# Altium schematic sheet ISP_CONNECTORS.SchDoc
size Letter; SheetNumber: 4; SheetTotal: 15
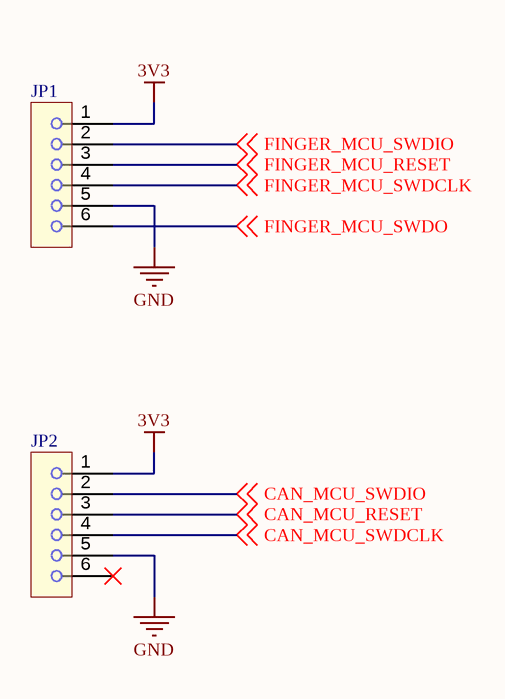
[diagram p0: ISP_CONNECTORS.SchDoc]

## Parts
JP1  TC2030-6-NL-FOOTPRINT  [TAG_TC2030_NL_6]  (value not drawn)  (no BOM)
JP2  TC2030-6-NL-FOOTPRINT  [TAG_TC2030_NL_6]  (value not drawn)  (no BOM)

## Nets
3V3: JP1.1 JP2.1
GND: JP1.5 JP2.5
CAN_MCU_RESET: JP2.3 ; off-sheet CAN_MCU_RESET
CAN_MCU_SWDCLK: JP2.4 ; off-sheet CAN_MCU_SWDCLK
CAN_MCU_SWDIO: JP2.2 ; off-sheet CAN_MCU_SWDIO
FINGER_MCU_RESET: JP1.3 ; off-sheet FINGER_MCU_RESET
FINGER_MCU_SWDCLK: JP1.4 ; off-sheet FINGER_MCU_SWDCLK
FINGER_MCU_SWDIO: JP1.2 ; off-sheet FINGER_MCU_SWDIO
FINGER_MCU_SWDO: JP1.6 ; off-sheet FINGER_MCU_SWDO

Not connected (* = marked no-connect by the designer): JP2 6*

## Notes on the sheet
- Title
- Copyright (c) Meta Platforms, Inc. and affiliates.
  All rights reserved.
  This source code is licensed under the license found in the
  LICENSE file in the root directory of this source tree.
- Sheet
- of

## Library data of the parts
JP1 JP2 = TC2030-6-NL-FOOTPRINT: CONN, FP, 2X3, .05, DEBUG, SMT; Manufacturer: NO PART; Part Number: FOOTPRINT ONLY